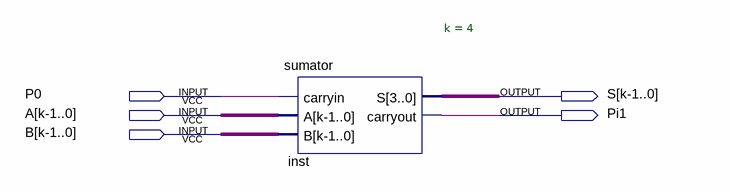
[diagram p0: schematic sheet]
// Quartus schematic Block1.bdf as structural Verilog: 1 symbols, 5 pins
module Block1 (
  input  P0,
  input  \A[k-1..0] ,
  input  \B[k-1..0] ,
  output \S[k-1..0] ,
  output Pi1
);

  wire [3:0] inst_s, undriven, undriven_2;

  sumator #(.k(4)) inst (.carryin(P0), .A(undriven), .B(undriven_2), .S(inst_s), .carryout(Pi1));
endmodule
